# EAGLE design tvbgone11 (EAGLE 5.12)
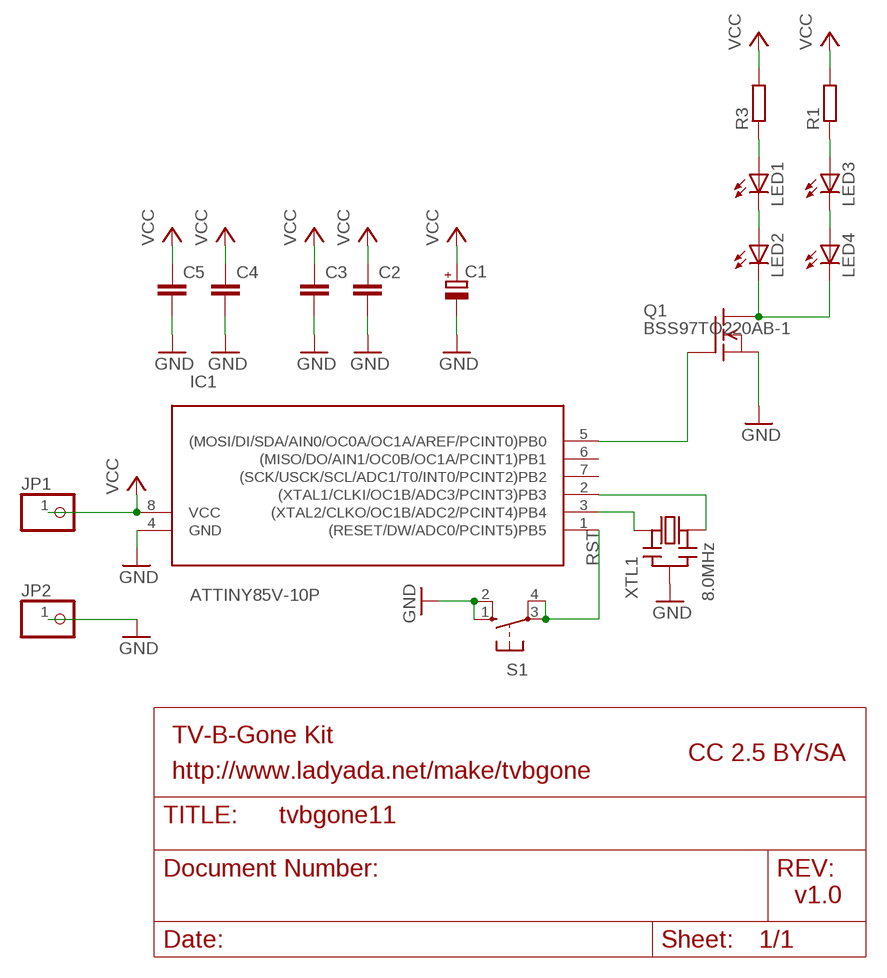
[diagram p0: schematic, sheet 1]

## Parts
C1  CPOL-EUE2.5-5  [E2,5-5]
C2  C-EUC1206  [C1206]
C3  C-EUC1206  [C1206]
C4  C-EUC1206  [C1206]
C5  C-EUC1206  [C1206]
IC1  ATTINY85V-10P  [DIL08]
JP1  PINHD-1X1  [1X01]
JP2  PINHD-1X1  [1X01]
LED1  LED5MM  [LED5MM]
LED2  LED5MM  [LED5MM]
LED3  LED5MM  [LED5MM]
LED4  LED5MM  [LED5MM]
Q1  BSS97TO220AB-1  [TO220AB-1]
R1  R-EU_0207/10  [0207/10]
R3  R-EU_0207/10  [0207/10]
S1  10-XX  [B3F-10XX]
XTL1  8.0MHz  CERMOSCILL  [CERM_OSC]

## Nets
GND: C1.- C2.2 C3.2 C4.2 C5.2 IC1.4(GND) JP2.1 Q1.S S1.1(S) S1.2(S1) XTL1.P$2(GND)
N$1: IC1.3((XTAL2/CLKO/OC1B/ADC2/PCINT4)PB4) XTL1.P$1(IN)
N$2: IC1.2((XTAL1/CLKI/OC1B/ADC3/PCINT3)PB3) XTL1.P$3(OUT)
N$3: LED1.K(C) LED2.A
N$4: IC1.5((MOSI/DI/SDA/AIN0/OC0A/OC1A/AREF/PCINT0)PB0) Q1.G
N$5: LED2.K(C) LED4.K(C) Q1.D
N$6: LED3.A R1.1
N$7: LED1.A R3.1
N$8: LED3.K(C) LED4.A
RST: IC1.1((RESET/DW/ADC0/PCINT5)PB5) S1.3(P) S1.4(P1)
VCC: C1.+ C2.1 C3.1 C4.1 C5.1 IC1.8(VCC) JP1.1 R1.2 R3.2
Unconnected: IC1.6((MISO/DO/AIN1/OC0B/OC1A/PCINT1)PB1) IC1.7((SCK/USCK/SCL/ADC1/T0/INT0/PCINT2)PB2)

## Notes on the sheet
- TV-B-Gone Kit
- CC 2.5 BY/SA
- http://www.ladyada.net/make/tvbgone
- v1.0

## Library data of the parts
C1 = rcl:CPOL-EU: POLARIZED CAPACITOR, European symbol
C2-C5 = rcl:C-EU: CAPACITOR, European symbol
IC1 = avr:ATTINY85: MICROCONTROLLER 8 Kbytes FLASH 512 bytes EEPROM 512 bytes RAM 4-channel 10 bit ADC USI
JP1 JP2 = pinhead:PINHD-1X1: PIN HEADER
LED1-LED4 = led:LED: LED OSRAM: - CHIPLED LG R971, LG N971, LY N971, LG Q971, LY Q971, LO R971, LY R971 LH N974, LH R974 LS Q976, LO Q976, LY Q976 LO Q996 - Hyper CHIPLED LW Q18S LB Q993, LB Q99A, LB R99A - SideLED LS A670, LO A670, LY A670, LG A670, LP A670 LB A673, LV A673, LT A673, LW A673 LH A674 LY A675 LS A676, LA A676, LO A676, LY A676, LW A676 LS A679, LY A679, LG A679 - Hyper Micro SIDELED® LS Y876, LA Y876, LO Y876, LY Y876 LT Y87S - SmartLED LW L88C, LW L88S LB L89C, LB L89S, LG L890 LS L89K, LO L89K, LY L89K LS L896, LA L896, LO L896, LY L896 - TOPLED LS T670, LO T670, LY T670, LG T670, LP T670 LSG T670, LSP T670, LSY T670, LOP T670, LYG T670 LG T671, LOG T671, LSG T671 LB T673, LV T673, LT T673, LW T673 LH T674 LS T676, LA T676, LO T676, LY T676, LB T676, LH T676, LSB T676, LW T676 LB T67C, LV T67C, LT T67C, LS T67K, LO T67K, LY T67K, LW E67C LS E67B, LA E67B, LO E67B, LY E67B, LB E67C, LV E67C, LT E67C LW T67C LS T679, LY T679, LG T679 LS T770, LO T770, LY T770, LG T770, LP T770 LB T773, LV T773, LT T773, LW T773 LH T774 LS E675, LA E675, LY E675, LS T675 LS T776, LA T776, LO T776, LY T776, LB T776 LHGB T686 LT T68C, LB T68C - Hyper Mini TOPLED® LB M676 - Mini TOPLED Santana® LG M470 LS M47K, LO M47K, LY M47K Source: http://www.osram.convergy.de LUXEON: - LUMILED® LXK2-PW12-R00, LXK2-PW12-S00, LXK2-PW14-U00, LXK2-PW14-V00 LXK2-PM12-R00, LXK2-PM12-S00, LXK2-PM14-U00 LXK2-PE12-Q00, LXK2-PE12-R00, LXK2-PE12-S00, LXK2-PE14-T00, LXK2-PE14-U00 LXK2-PB12-K00, LXK2-PB12-L00, LXK2-PB12-M00, LXK2-PB14-N00, LXK2-PB14-P00, LXK2-PB14-Q00 LXK2-PR12-L00, LXK2-PR12-M00, LXK2-PR14-Q00, LXK2-PR14-R00 LXK2-PD12-Q00, LXK2-PD12-R00, LXK2-PD12-S00 LXK2-PH12-R00, LXK2-PH12-S00 LXK2-PL12-P00, LXK2-PL12-Q00, LXK2-PL12-R00 Source: www.luxeon.com KINGBRIGHT: KA-3528ASYC Source: www.kingbright.com
Q1 = n-ch-transistor2:BSS97: N-Channel Enhancement MOSFET 200V; 1.5A; 1,6Ohm
R1 R3 = rcl:R-EU_: RESISTOR, European symbol
S1 = switch-omron:10-XX: OMRON SWITCH; MPN: B3F-1000; OC_FARNELL: 176432; OC_NEWARK: 36M3542
XTL1 = digg:CERMOSCILL

## Board
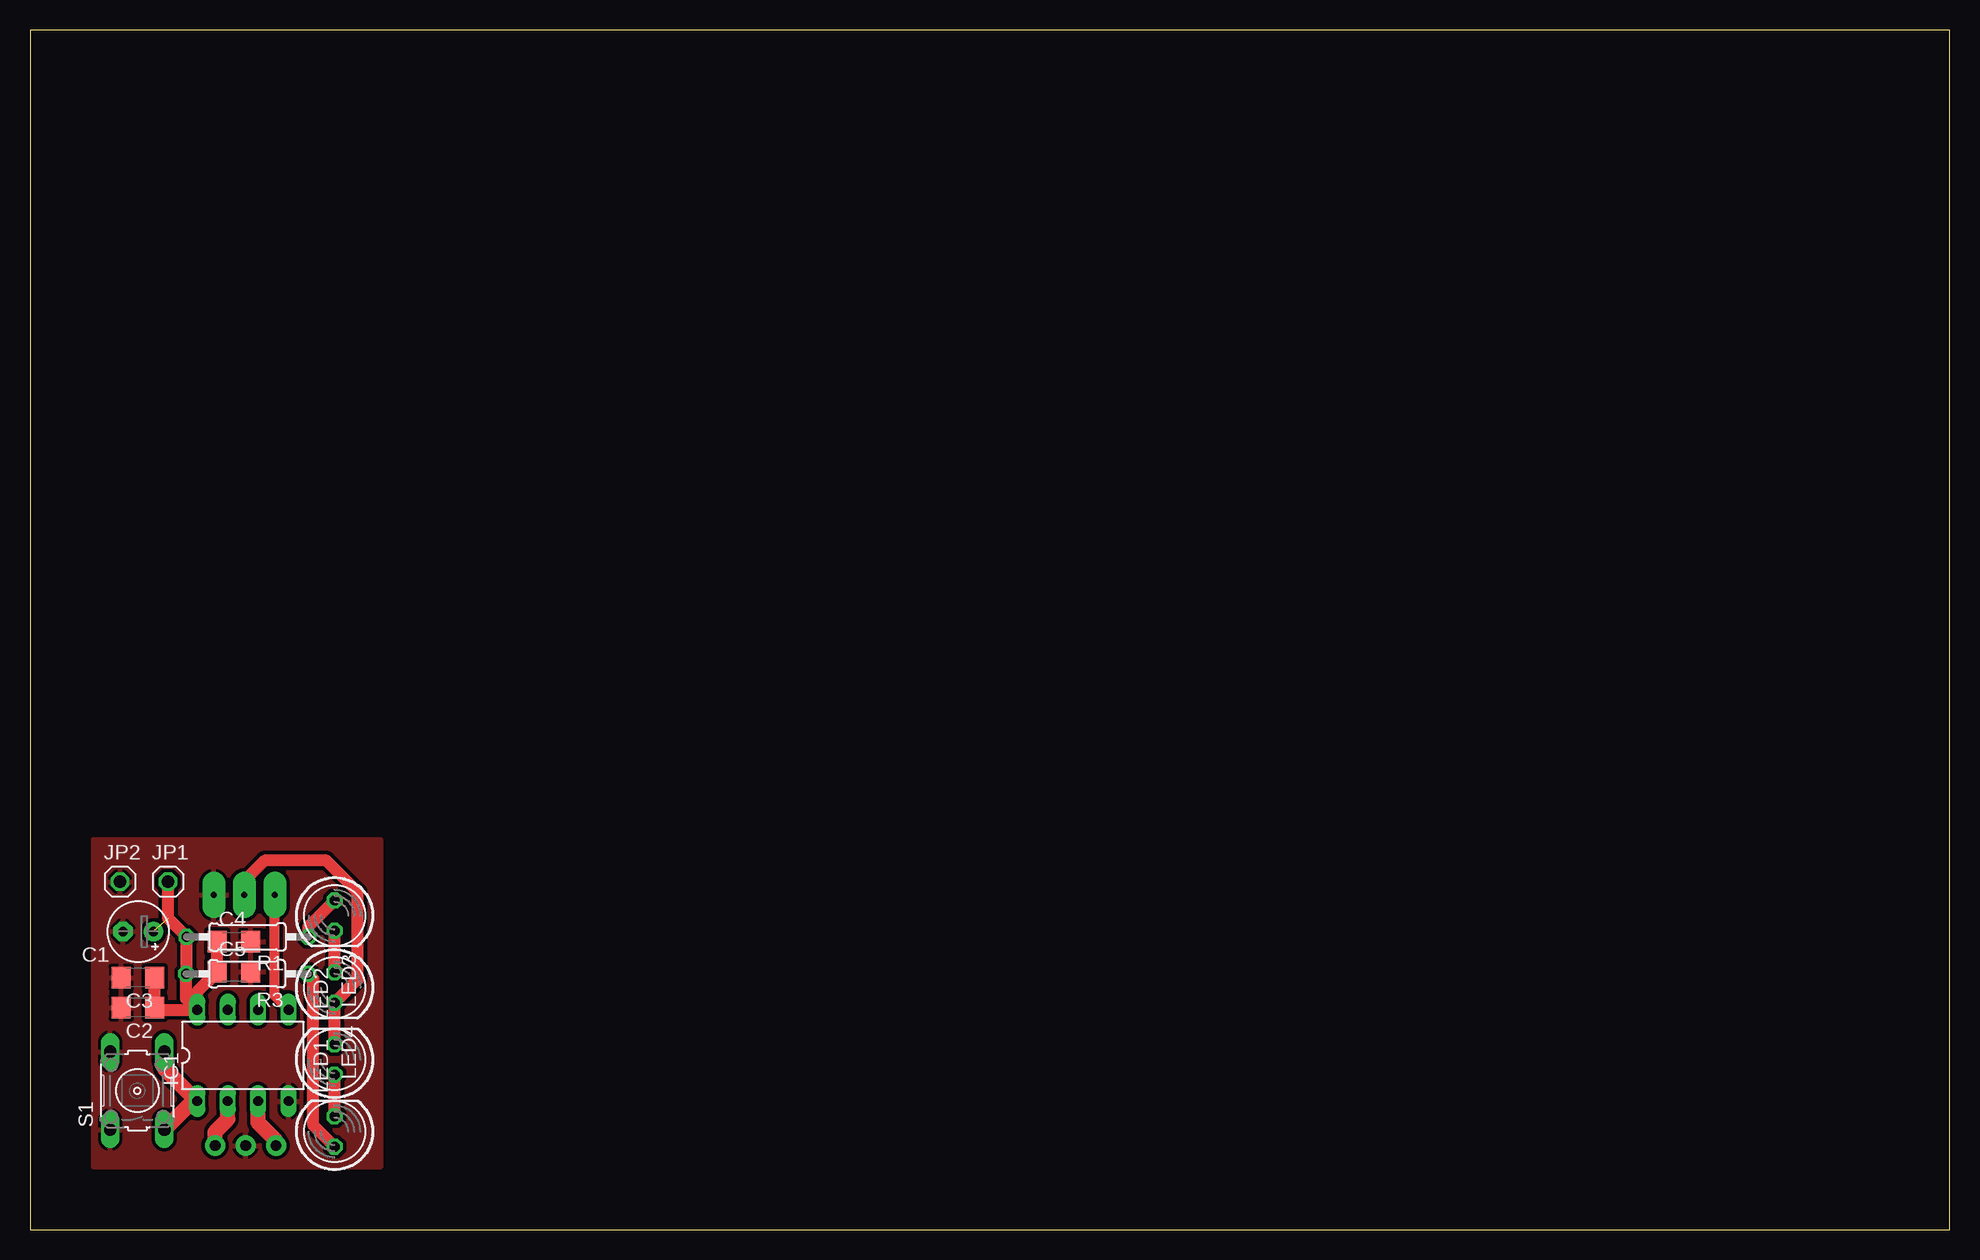
[diagram p1: board, top side]
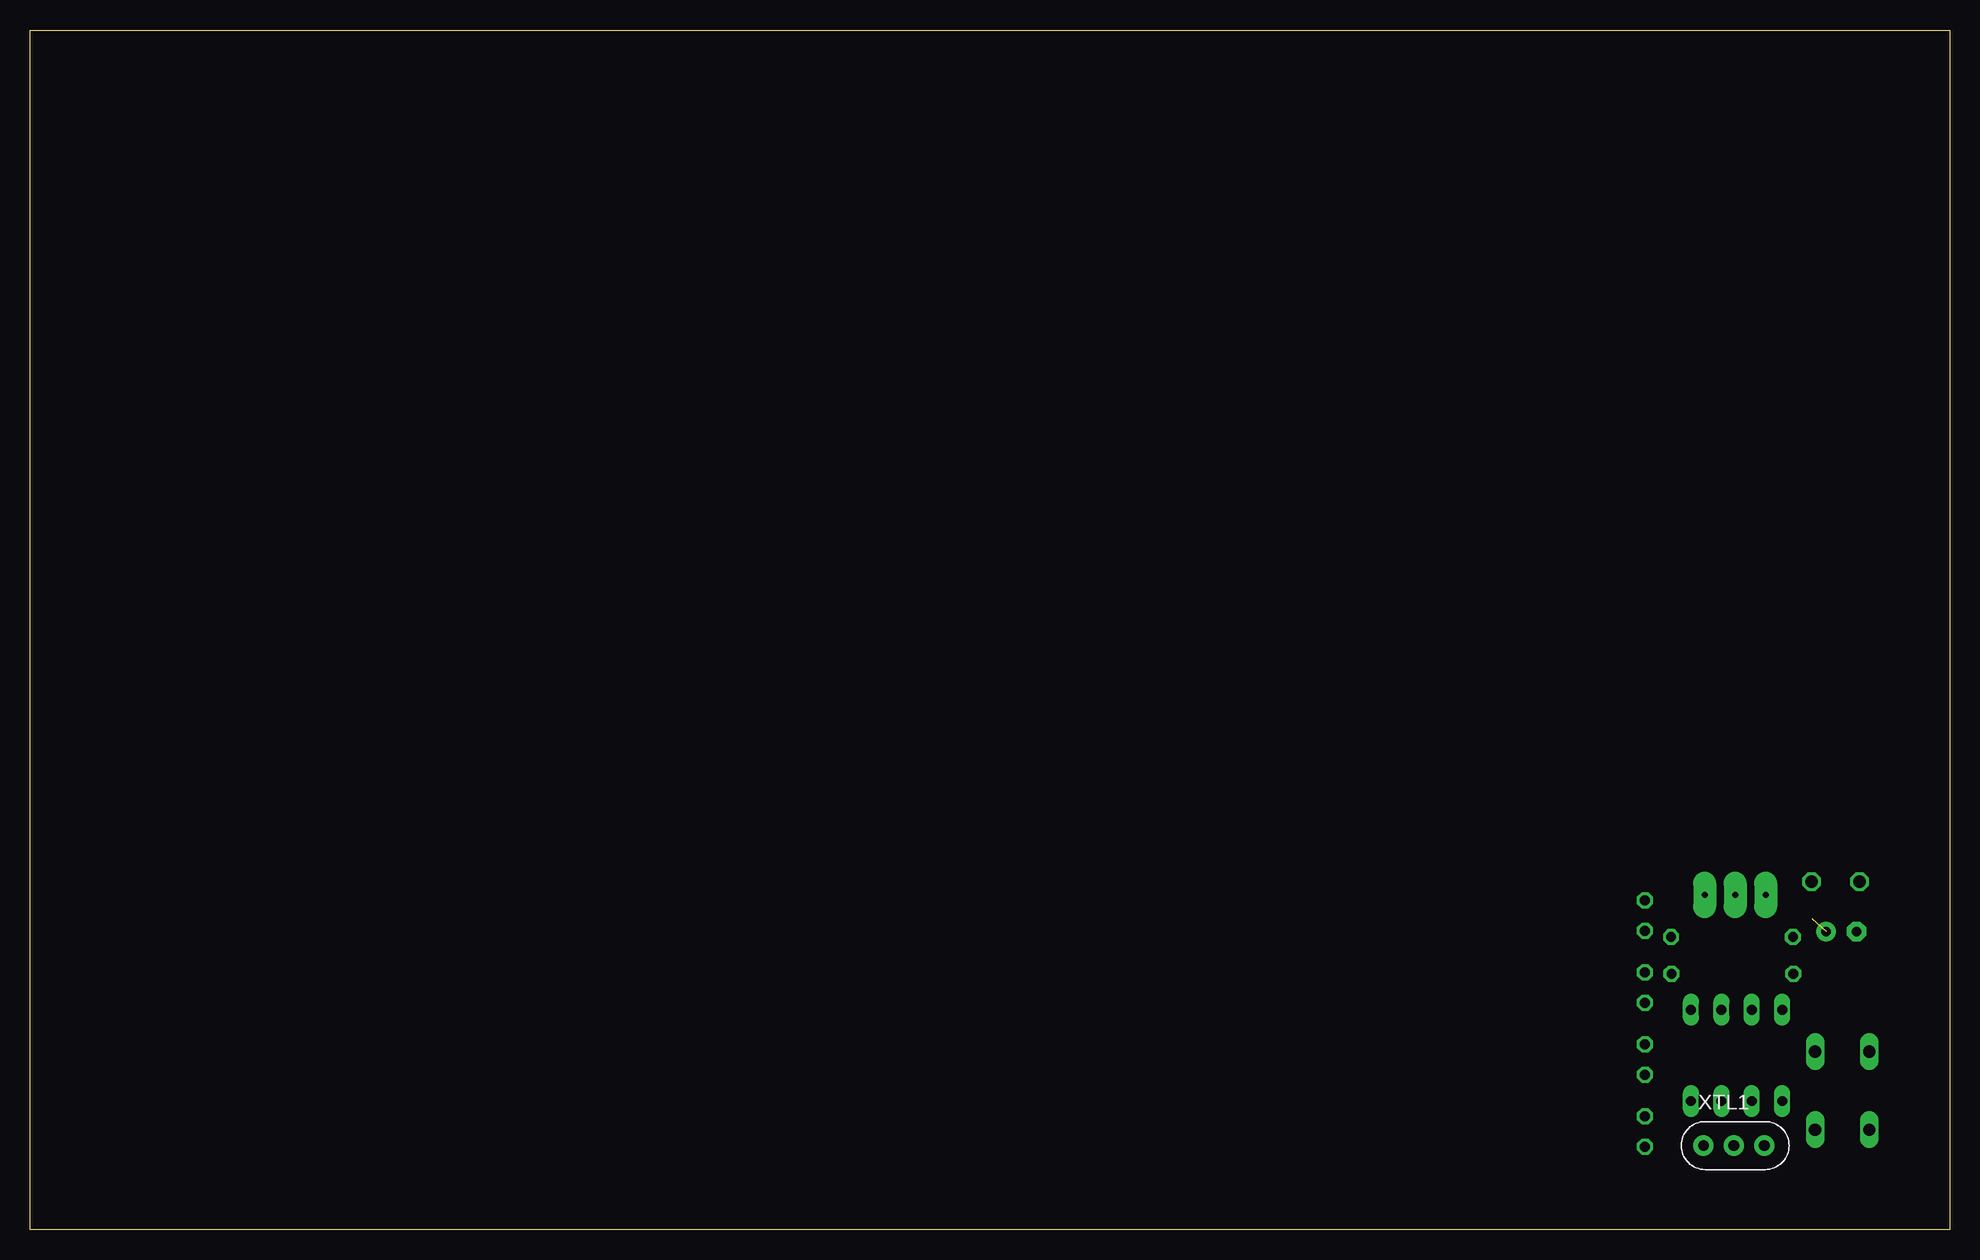
[diagram p2: board, bottom side, seen from below]

Size 160 x 100 mm. Coordinates in mm from the lower left corner, seen from the top.
Outline: 0,0 160,0 160,100 0,100 0,0
Copper layers (1*16): Top 0.035mm / dielectric 1.5mm / Bottom 0.035mm
Design rules "default *": minimum track width 12mil, minimum drill 4mil, track to track 12mil, track to pad 12mil, pad to pad 12mil, via to via 12mil, smd to smd 12mil, copper to edge 40mil, drill to drill 12mil, minimum pad ring 10mil, minimum via ring 8mil, stop-mask expansion 4mil, vias tented up to drill 0mil, thermal gap 10mil

### Footprints (pad centres in the part's own frame; a part is rotated, then mirrored left to right if it is on the bottom)
E2,5-5 = drill 0.813 pad 1.6 round: + -1.27,0 | drill 0.813 pad 1.6 octagon: - 1.27,0
C1206 = smd 1.6 x 1.8: 1 -1.4,0; 2 1.4,0
DIL08 = drill 0.813 long: 1 -3.81,-3.81; 2 -1.27,-3.81; 3 1.27,-3.81; 4 3.81,-3.81; 5 3.81,3.81; 6 1.27,3.81; 7 -1.27,3.81; 8 -3.81,3.81
1X01 = drill 1.016 octagon: 1 0,0
LED5MM = drill 0.813 octagon: A -1.27,0; K 1.27,0
TO220AB-1 = drill 0.5 pad 1.93 long: D 0,0; G -2.54,0; S 2.54,0
0207/10 = drill 0.813 octagon: 1 -5.08,0; 2 5.08,0
B3F-10XX = drill 1.016 long: 1 -3.251,2.261; 2 3.251,2.261; 3 -3.251,-2.261; 4 3.251,-2.261
CERM_OSC = drill 0.9 pad 1.676 round: P$1 -2.54,0; P$2 0,0; P$3 2.54,0

### Placement (x,y rotation side)
C1  9.02,24.84 180 top
C2  9,18.5 180 top
C3  9,21 180 top
C4  17,24 0 top
C5  17,21.5 0 top
IC1  17.75,14.51 0 top
JP1  11.5,29 0 top
JP2  7.5,29 0 top
LED1  25.39,8.17 90 top
LED2  25.39,14.17 90 top
LED3  25.39,26.17 270 top
LED4  25.39,20.17 270 top
Q1  17.86,27.9 180 top
R1  18.13,24.39 180 top
R3  18.1,21.32 180 top
S1  8.95,11.57 90 top
XTL1  17.97,7 0 bottom

### Tracks (layer width: path | path; a pad name or v marks a point on that pad's centre or on a via)
GND
  pour Top: 5.25,5.25 29.25,5.25 29.25,32.5 5.25,32.5
N$1
  Top 1.27: XTL1.P$1 20.51,7.41 19.02,8.9 IC1.3
N$2
  Top 1.27: XTL1.P$3 15.43,8.14 16.48,9.19 IC1.2
N$3
  Top 1.016: LED1.K LED2.A
N$4
  Top 0.813: IC1.5 20.4,19.48 Q1.G
N$5
  Top 0.813: 17.86,29.05 Q1.D
  Top 1.016: LED2.K LED4.K 27.33,20.84 27.33,28.13 24.69,30.77 19.58,30.77 17.86,29.05
N$6
  Top 1.016: R1.1 23.21,25.26 LED3.A
N$7
  Top 1.016: R3.1 23.62,20.87 23.62,8.67 LED1.A
N$8
  Top 1.016: LED4.A LED3.K
RST
  Top 0.813: 13.58,10.7 IC1.1
  Top 1.27: S1.3 13.58,10.7 | IC1.1 11.21,13.43 S1.4
VCC  (1 unrouted)
  Top 1.016: JP1.1 11.5,25.94 R1.2 13.05,21.35 R3.2 13.02,19.24 IC1.8 | IC1.8 10.58,18.32 C2.1 C3.1 | C4.1 C5.1 13.94,19.84 IC1.8